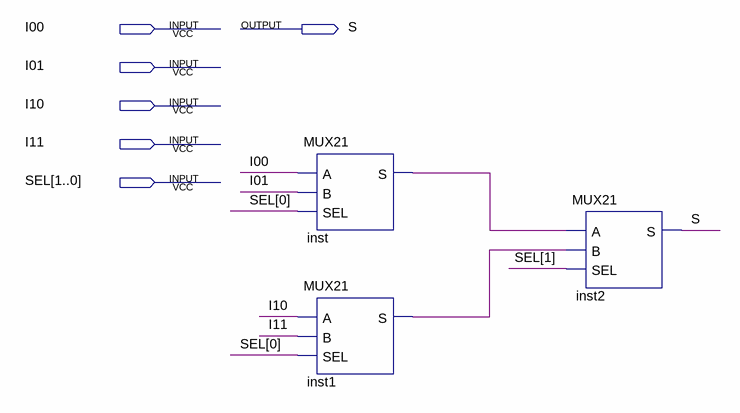
[diagram p0: schematic sheet]
// Quartus schematic MUX41.bdf as structural Verilog: 3 symbols, 6 pins
module MUX41 (
  input  I00,
  input  I01,
  input  I10,
  input  I11,
  input  [1:0] SEL,
  output S
);

  wire inst1_s, inst_s;

  MUX21 inst (.A(I00), .B(I01), .SEL(SEL[0]), .S(inst_s));
  MUX21 inst1 (.A(I10), .B(I11), .SEL(SEL[0]), .S(inst1_s));
  MUX21 inst2 (.A(inst_s), .B(inst1_s), .SEL(SEL[1]), .S(S));
endmodule
